# EAGLE design untitled (EAGLE 5.10)
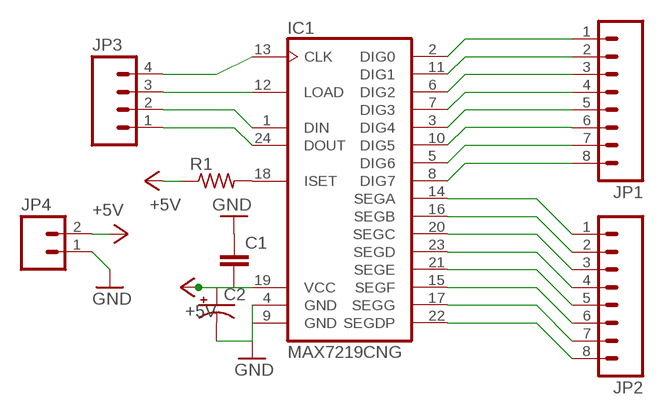
[diagram p0: schematic, sheet 1]

## Parts
C1  CAPPTH  [CAP-PTH-SMALL]
C2  CAP_POLPTH2  [CPOL-RADIAL-10UF-25V]
IC1  MAX7219CNG  [DIL24-3]
JP1  M08  [1X08]
JP2  M08  [1X08]
JP3  M04PTH  [1X04]
JP4  M02PTH  [1X02]
R1  R-US_0207/2V  [0207/2V]

## Nets
+5V: C1.2 C2.1(+) IC1.19(VCC) JP4.2 R1.1
GND: C1.1 C2.2(-) IC1.4(GND) IC1.9(GND) JP4.1
N$1: IC1.2(DIG0) JP1.1
N$2: IC1.11(DIG1) JP1.2
N$3: IC1.6(DIG2) JP1.3
N$4: IC1.7(DIG3) JP1.4
N$5: IC1.3(DIG4) JP1.5
N$6: IC1.10(DIG5) JP1.6
N$7: IC1.5(DIG6) JP1.7
N$8: IC1.8(DIG7) JP1.8
N$9: IC1.14(SEGA) JP2.1
N$10: IC1.16(SEGB) JP2.2
N$11: IC1.20(SEGC) JP2.3
N$12: IC1.23(SEGD) JP2.4
N$13: IC1.21(SEGE) JP2.5
N$14: IC1.15(SEGF) JP2.6
N$15: IC1.17(SEGG) JP2.7
N$16: IC1.22(SEGDP) JP2.8
N$17: IC1.24(DOUT) JP3.1
N$18: IC1.1(DIN) JP3.2
N$19: IC1.13(CLK) JP3.4
N$20: IC1.12(LOAD) JP3.3
N$21: IC1.18(ISET) R1.2

## Library data of the parts
C1 = SparkFun:CAP: Capacitor Standard 0603 ceramic capacitor, and 0.1" leaded capacitor.
C2 = SparkFun:CAP_POL: Capacitor Polarized These are standard SMD and PTH capacitors. Normally 10uF, 47uF, and 100uF in electrolytic and tantalum varieties. Always verify the external diameter of the through hole cap, it varies with capacity, voltage, and manufacturer. The EIA devices should be standard.
IC1 = maxim:MAX7219CNG: LED DISPLAY DRIVER
JP1 JP2 = SparkFun:M08: Header 8 Standard 8-pin 0.1" header. Use with straight break away headers (SKU : PRT-00116), right angle break away headers (PRT-00553), swiss pins (PRT-00743), machine pins (PRT-00117), and female headers (PRT-00115).
JP3 = SparkFun:M04: Header 4 Standard 4-pin 0.1" header. Use with straight break away headers (SKU : PRT-00116), right angle break away headers (PRT-00553), swiss pins (PRT-00743), machine pins (PRT-00117), and female headers (PRT-00115). Molex polarized connector foot print use with SKU : PRT-08231 with associated crimp pins and housings.
JP4 = SparkFun:M02: Header 2 Standard 2-pin 0.1" header. Use with straight break away headers (SKU : PRT-00116), right angle break away headers (PRT-00553), swiss pins (PRT-00743), machine pins (PRT-00117), and female headers (PRT-00115). Molex polarized connector foot print use with SKU : PRT-08233 with associated crimp pins and housings.
R1 = resistor:R-US_: RESISTOR, American symbol

## Board
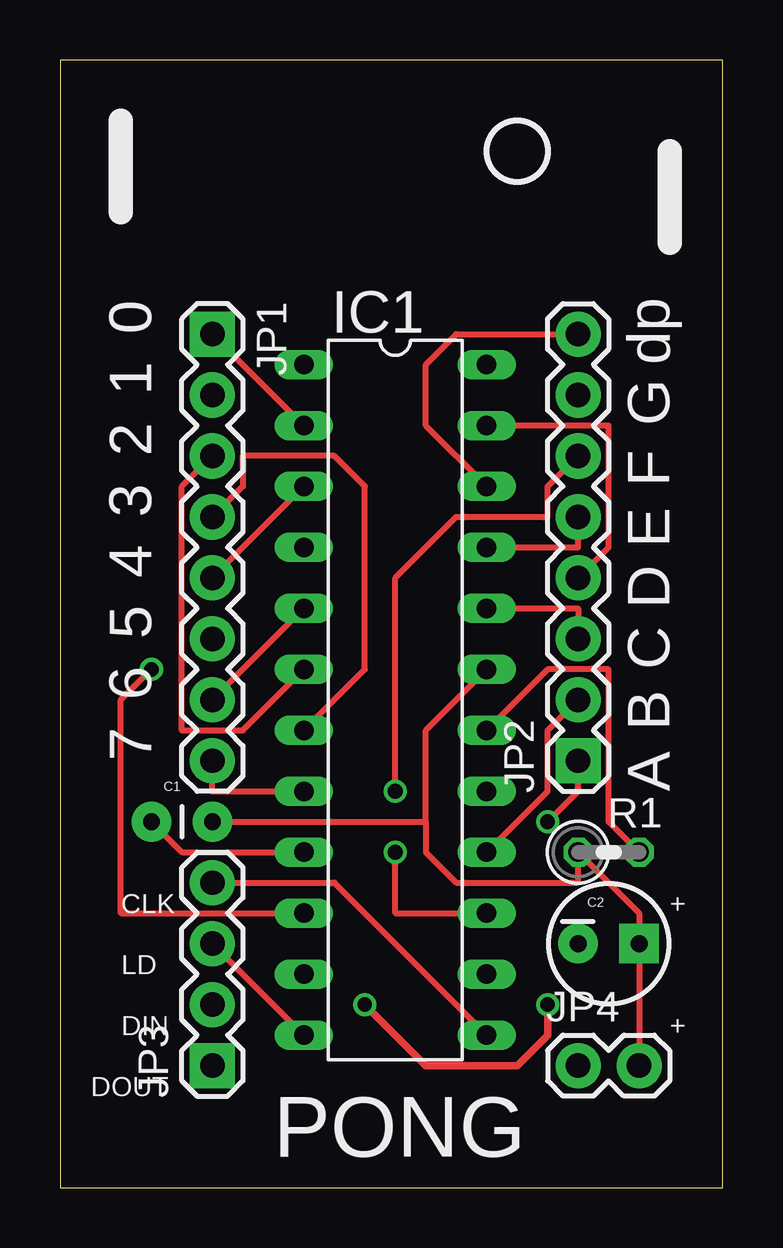
[diagram p1: board, top side]
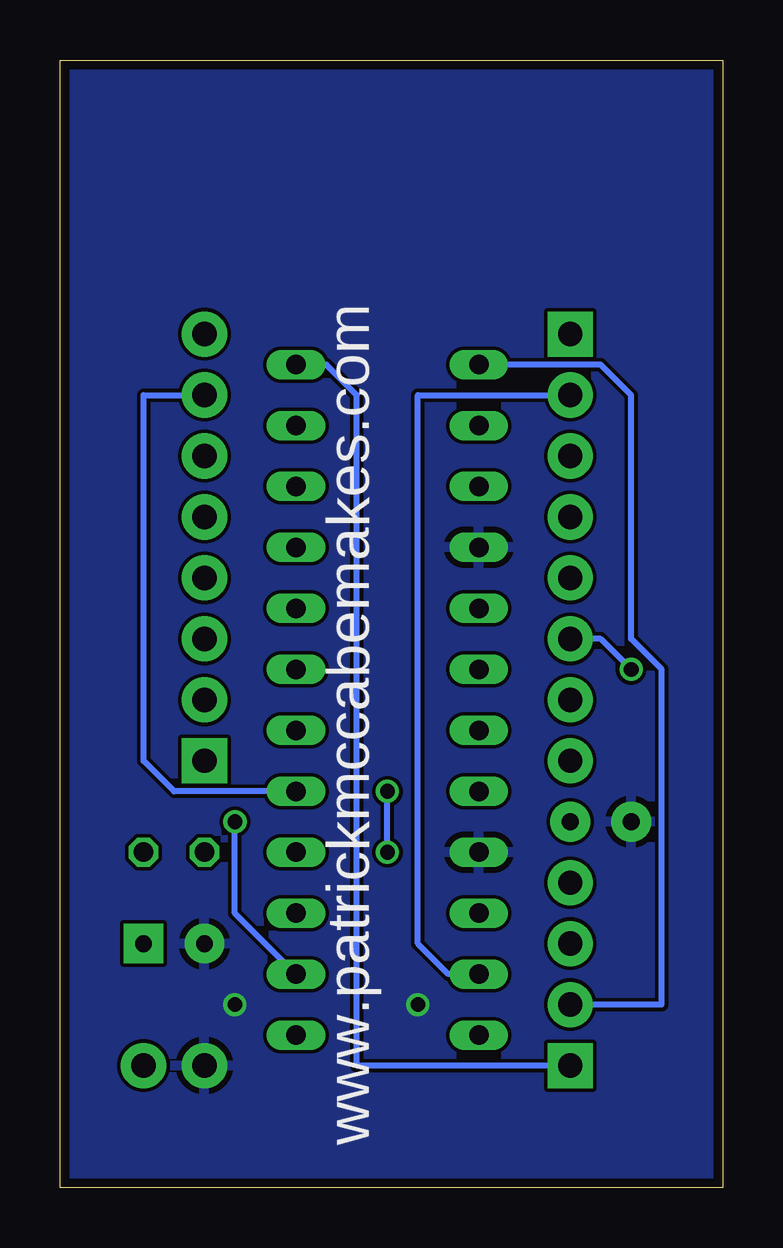
[diagram p2: board, bottom side, seen from below]

Size 27.61 x 46.98 mm. Coordinates in mm from the lower left corner, seen from the top.
Outline: 0,0 27.61,0 27.61,46.98 0,46.98 0,0
Copper layers (1*16): Top 0.0356mm / dielectric 1.5011mm / Bottom 0.0356mm
Design rules "Dorkbot": minimum track width 6mil, minimum drill 13mil, track to track 6mil, track to pad 6mil, pad to pad 6mil, via to via 6mil, smd to smd 6mil, copper to edge 15mil, drill to drill 6mil, minimum pad ring 7mil, minimum via ring 7mil, stop-mask expansion 4mil, vias tented up to drill 0mil, thermal gap 10mil

### Footprints (pad centres in the part's own frame; a part is rotated, then mirrored left to right if it is on the bottom)
CAP-PTH-SMALL = drill 0.7 pad 1.651 round: 1 0,0; 2 2.54,0
CPOL-RADIAL-10UF-25V = drill 0.7 pad 1.651 square: 1 1.27,0 | drill 0.7 pad 1.651 round: 2 -1.27,0
DIL24-3 = drill 0.813 long: 1 -13.97,-3.81; 2 -11.43,-3.81; 3 -8.89,-3.81; 4 -6.35,-3.81; 5 -3.81,-3.81; 6 -1.27,-3.81; 7 1.27,-3.81; 8 3.81,-3.81; 9 6.35,-3.81; 10 8.89,-3.81; 11 11.43,-3.81; 12 13.97,-3.81; 13 13.97,3.81; 14 11.43,3.81; 15 8.89,3.81; 16 6.35,3.81; 17 3.81,3.81; 18 1.27,3.81; 19 -1.27,3.81; 20 -3.81,3.81; 21 -6.35,3.81; 22 -8.89,3.81; 23 -11.43,3.81; 24 -13.97,3.81
1X08 = drill 1.016 pad 1.88 square: 1 0,0 | drill 1.016 pad 1.88 round: 2 2.54,0; 3 5.08,0; 4 7.62,0; 5 10.16,0; 6 12.7,0; 7 15.24,0; 8 17.78,0
1X04 = drill 1.016 pad 1.88 square: 1 0,0 | drill 1.016 pad 1.88 round: 2 2.54,0; 3 5.08,0; 4 7.62,0
1X02 = drill 1.016 pad 1.88 round: 1 0,0; 2 2.54,0
0207/2V = drill 0.813 octagon: 1 -1.27,0; 2 1.27,0

### Placement (x,y rotation side)
C1  3.81,15.24 0 top
C2  22.86,10.16 0 top
IC1  13.97,20.32 270 top
JP1  6.35,35.56 270 top
JP2  21.59,17.78 90 top
JP3  6.35,5.08 90 top
JP4  21.59,5.08 0 top
R1  22.86,13.97 0 top

### Tracks (layer width: path | path; a pad name or v marks a point on that pad's centre or on a via)
+5V
  Top 0.254: IC1.19 15.24,19.05 15.24,15.24 | 15.24,15.24 15.24,13.97 16.51,12.7 21.59,12.7 R1.1 24.13,11.43 C2.1 JP4.2 | C1.2 15.24,15.24
GND  (via drill 0.6)
  Top 0.254: C1.1 5.08,13.97 IC1.9
  Top 0.305: v12.7,7.62 15.24,5.08 19.05,5.08 20.32,6.35 v20.32,7.62
  pour Bottom: 0,46.99 27.94,46.99 27.94,0 0,0
N$1
  Top 0.254: JP1.1 IC1.2
N$2
  Bottom 0.254: IC1.11 11.43,8.89 12.7,10.16 12.7,33.02 JP1.2
N$3
  Top 0.254: IC1.6 7.62,19.05 5.08,19.05 5.08,29.21 JP1.3
N$4
  Top 0.254: IC1.7 12.7,21.59 12.7,29.21 11.43,30.48 7.62,30.48 7.62,29.21 JP1.4
N$5
  Top 0.254: JP1.5 IC1.3
N$6  (via drill 0.61)
  Top 0.254: IC1.10 2.54,11.43 2.54,20.32 v3.81,21.59
  Bottom 0.254: v3.81,21.59 5.08,22.86 JP1.6
N$7
  Top 0.254: JP1.7 IC1.5
N$8
  Top 0.254: IC1.8 6.35,16.51 JP1.8
N$9  (via drill 0.61)
  Top 0.254: v20.32,15.24 21.59,16.51 JP2.1
  Bottom 0.254: IC1.14 20.32,11.43 v20.32,15.24
N$10
  Top 0.254: IC1.16 20.32,16.51 20.32,19.05 JP2.2
N$11
  Top 0.254: IC1.20 21.59,24.13 JP2.3
N$12
  Top 0.254: IC1.23 22.86,31.75 22.86,26.67 JP2.4
N$13
  Top 0.254: IC1.21 21.59,26.67 JP2.5
N$14  (via drill 0.61)
  Top 0.254: IC1.15 13.97,11.43 v13.97,13.97 | v13.97,16.51 13.97,25.4 16.51,27.94 20.32,27.94 20.32,29.21 JP2.6
  Bottom 0.254: v13.97,13.97 v13.97,16.51
N$15
  Bottom 0.254: IC1.17 22.86,16.51 24.13,17.78 24.13,33.02 JP2.7
N$16
  Top 0.254: IC1.22 15.24,31.75 15.24,34.29 16.51,35.56 JP2.8
N$17
  Bottom 0.254: IC1.24 16.51,34.29 15.24,33.02 15.24,5.08 JP3.1
N$18
  Bottom 0.254: IC1.1 5.08,34.29 3.81,33.02 3.81,22.86 2.54,21.59 2.54,7.62 JP3.2
N$19
  Top 0.254: IC1.13 11.43,12.7 JP3.4
N$20
  Top 0.254: IC1.12 JP3.3
N$21
  Top 0.254: R1.2 22.86,15.24 22.86,21.59 20.32,21.59 IC1.18

### Text on the board
tPlace: 0 | dp | 1 | G | 2 | F | 3 | E | 4 | D | 5 | C | 6 | B | 7 | A | CLK | + | LD | DIN | + | DOUT | PONG
bPlace: www.patrickmccabemakes.com